# Altium schematic sheet Active Sensor BB.SchDoc
size A4; Organization: Altium Limited; Address1: L3, 12a Rodborough Rd; Address2: Frenchs Forest; Address3: NSW; Address4: Australia 2086; SheetNumber: 1; SheetTotal: 2; TitleBlk1Sch: PCBA, A.E BREAKOUT, REV 3.1, AMBER; TitleBlk2Sch: Active Sensor Board; EngDate: 12-18-18; RevSch: 01; Eng: Haman
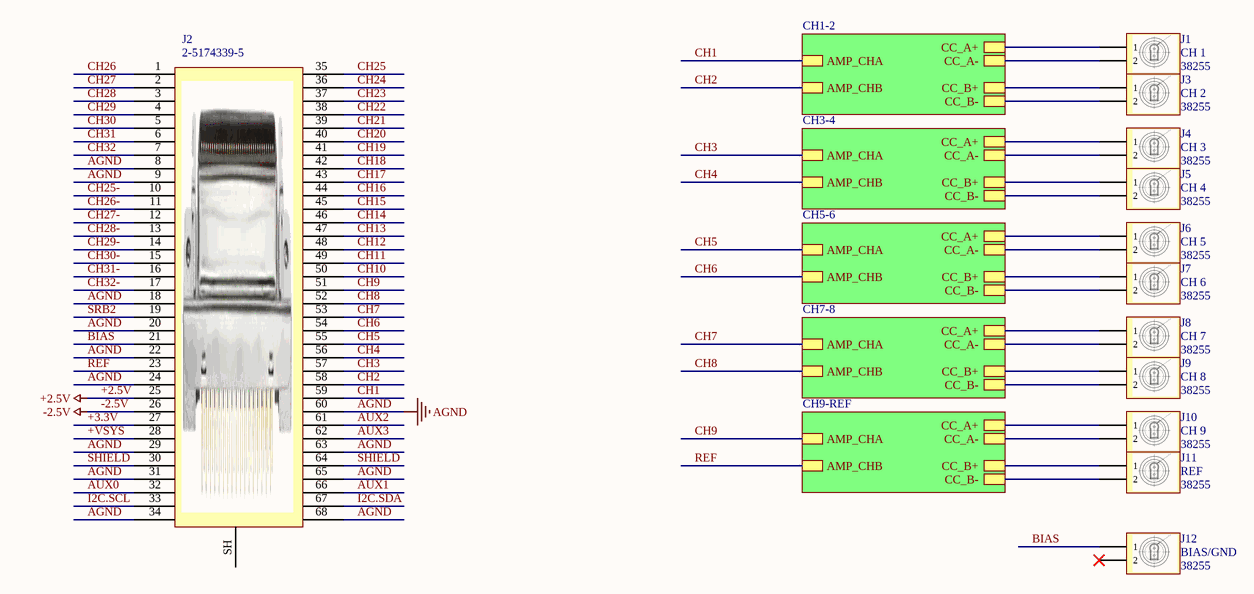
[diagram p0: Active Sensor BB.SchDoc]

## Parts
J1  CH 1  [38255]
J2  10268-6212PC  [2-5174339-5]  (value not drawn)
J3  CH 2  [38255]
J4  CH 3  [38255]
J5  CH 4  [38255]
J6  CH 5  [38255]
J7  CH 6  [38255]
J8  CH 7  [38255]
J9  CH 8  [38255]
J10  CH 9  [38255]
J11  REF  [38255]
J12  BIAS/GND  [38255]

## Sub-sheets
CH1-2 = CC CHANNEL.SchDoc: CC_A+, CC_A-, AMP_CHA, AMP_CHB, CC_B+, CC_B-
CH3-4 = CC CHANNEL.SchDoc: CC_A+, CC_A-, AMP_CHA, AMP_CHB, CC_B+, CC_B-
CH5-6 = CC CHANNEL.SchDoc: CC_A+, CC_A-, AMP_CHA, AMP_CHB, CC_B+, CC_B-
CH7-8 = CC CHANNEL.SchDoc: CC_A+, CC_A-, AMP_CHA, AMP_CHB, CC_B+, CC_B-
CH9-REF = CC CHANNEL.SchDoc: CC_A+, CC_A-, AMP_CHA, AMP_CHB, CC_B+, CC_B-

## Nets
+2.5V: J2.25
-2.5V: J2.26
AGND: J2.8 J2.9 J2.18 J2.20 J2.22 J2.24 J2.29 J2.31 J2.34 J2.60 J2.63 J2.65 J2.68
+3.3V: J2.27
+VSYS: J2.28
AUX0: J2.32
AUX1: J2.66
AUX2: J2.61
AUX3: J2.62
BIAS: J2.21 J12.1
CH1: J2.59 ; sheet CH1-2/AMP_CHA
CH2: J2.58 ; sheet CH1-2/AMP_CHB
CH3: J2.57 ; sheet CH3-4/AMP_CHA
CH4: J2.56 ; sheet CH3-4/AMP_CHB
CH5: J2.55 ; sheet CH5-6/AMP_CHA
CH6: J2.54 ; sheet CH5-6/AMP_CHB
CH7: J2.53 ; sheet CH7-8/AMP_CHA
CH8: J2.52 ; sheet CH7-8/AMP_CHB
CH9: J2.51 ; sheet CH9-REF/AMP_CHA
CH10: J2.50
CH11: J2.49
CH12: J2.48
CH13: J2.47
CH14: J2.46
CH15: J2.45
CH16: J2.44
CH17: J2.43
CH18: J2.42
CH19: J2.41
CH20: J2.40
CH21: J2.39
CH22: J2.38
CH23: J2.37
CH24: J2.36
CH25: J2.35
CH25-: J2.10
CH26: J2.1
CH26-: J2.11
CH27: J2.2
CH27-: J2.12
CH28: J2.3
CH28-: J2.13
CH29: J2.4
CH29-: J2.14
CH30: J2.5
CH30-: J2.15
CH31: J2.6
CH31-: J2.16
CH32: J2.7
CH32-: J2.17
I2C.SCL: J2.33
I2C.SDA: J2.67
REF: J2.23 ; sheet CH9-REF/AMP_CHB
SHIELD: J2.30 J2.64
SRB2: J2.19
NetJ1_1: J1.1 ; sheet CH1-2/CC_A+
NetJ1_2: J1.2 ; sheet CH1-2/CC_A-
NetJ3_1: J3.1 ; sheet CH1-2/CC_B+
NetJ3_2: J3.2 ; sheet CH1-2/CC_B-
NetJ4_1: J4.1 ; sheet CH3-4/CC_A+
NetJ4_2: J4.2 ; sheet CH3-4/CC_A-
NetJ5_1: J5.1 ; sheet CH3-4/CC_B+
NetJ5_2: J5.2 ; sheet CH3-4/CC_B-
NetJ6_1: J6.1 ; sheet CH5-6/CC_A+
NetJ6_2: J6.2 ; sheet CH5-6/CC_A-
NetJ7_1: J7.1 ; sheet CH5-6/CC_B+
NetJ7_2: J7.2 ; sheet CH5-6/CC_B-
NetJ8_1: J8.1 ; sheet CH7-8/CC_A+
NetJ8_2: J8.2 ; sheet CH7-8/CC_A-
NetJ9_1: J9.1 ; sheet CH7-8/CC_B+
NetJ9_2: J9.2 ; sheet CH7-8/CC_B-
NetJ10_1: J10.1 ; sheet CH9-REF/CC_A+
NetJ10_2: J10.2 ; sheet CH9-REF/CC_A-
NetJ11_1: J11.1 ; sheet CH9-REF/CC_B+
NetJ11_2: J11.2 ; sheet CH9-REF/CC_B-

Not connected (* = marked no-connect by the designer): J2 SH; J12 2*

## Notes on the sheet
- Title:
- USA
- 100 Mayfield Avenue
- Mountain View, CA 94043
- Variant Name:
- Confidential and Proprietary
- Engineer:
- Date:
- Size:
- A4
- Template:
- 992-00283-00 A
- Dwg No:
- Sheet:
- Rev:
- of

## Library data of the parts
J1 J3-J12 = 38255: MANUFACTURER: PLASTICS1; DESCRIPTION1: TOUCHLESS CONNECTOR; MANUFACTURER PART NUMBER: 38255
J2 = 10268-6212PC: Manufacturer: TE Connectivity; Description1: TE CONNECTIVITY / AMP         2-5174339-5             Standard D Sub Connector, Vertical, AMPLIMITE 0.050 Series, Plug, 68 Contacts, Steel Body; 3D Model: 2-5174339-5.pdf; Connector Style: D-Type; Connector Type: Cap, Male Pins; Number of Positions: 68; Flange Feature: Housing/Shell (M2.5); Voltage Rating: 100V; Current Rating: 1A; Supplier 1: Digi-Key; Supplier Part Number 1: A121355-ND; Manufacturer Part Number: 2-5174339-5; Stock 1: 1867; Pricing 1: 1=20.4, 10=18.414, 25=17.6424, 50=16.5398, 100=15.9885, 250=15.1064, 500=14.6653 (USD); RoHS Information: 2-5174339-5 Statement of Compliance; Standard Package: 420; Category: Connectors, Interconnects; Family: D-Sub Connectors; Series: AMPLIMITE .050 II; Number of Rows: 2; Shell Size, Connector Layout: 0.050 Pitch x 0.100 Row to Row; Contact Type: Signal; Mounting Type: Through Hole; Termination: Solder; Features: Shielded; Shell Material, Finish: Zinc, Nickel Plated; Contact Finish: Gold; Contact Finish Thickness: 30µin (0.76µm); Operating Temperature: -55°C ~ 85°C; Housing Material: Polybutylene Terephthalate (PBT); Color: Black